# Altium schematic sheet TopLevel.SchDoc
size 420 x 297 mm; SheetNumber: 1; SheetTotal: 4
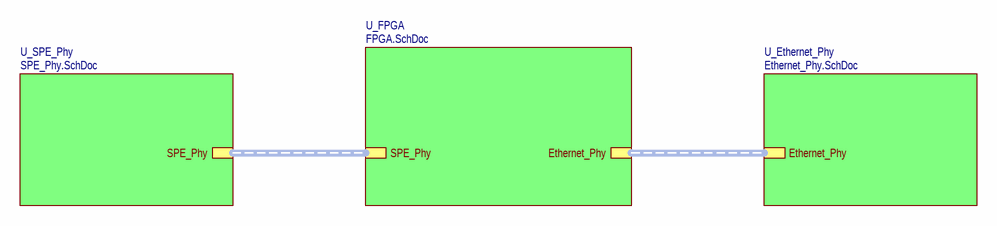
[diagram p0: TopLevel.SchDoc]

## Sub-sheets
U_Ethernet_Phy = Ethernet_Phy.SchDoc: Ethernet_Phy (harness Ethernet)
U_FPGA = FPGA.SchDoc: Ethernet_Phy (harness Ethernet), SPE_Phy (harness SPE)
U_SPE_Phy = SPE_Phy.SchDoc: SPE_Phy (harness SPE)

## Buses and harness runs
harness sheet U_Ethernet_Phy/Ethernet_Phy = sheet U_FPGA/Ethernet_Phy
harness sheet U_FPGA/SPE_Phy = sheet U_SPE_Phy/SPE_Phy

## Notes on the sheet
- Подп. дата
- Инв. № дубл.
- Взам. инв. №
- Подп. и дата
- Инв. № подл.
- Изм.
- Лист
- № докум.
- Подп.
- Дата
- ALTIUM GOSTBOM2.0 KEV
- Файл:
- Копировал
- Формат А3